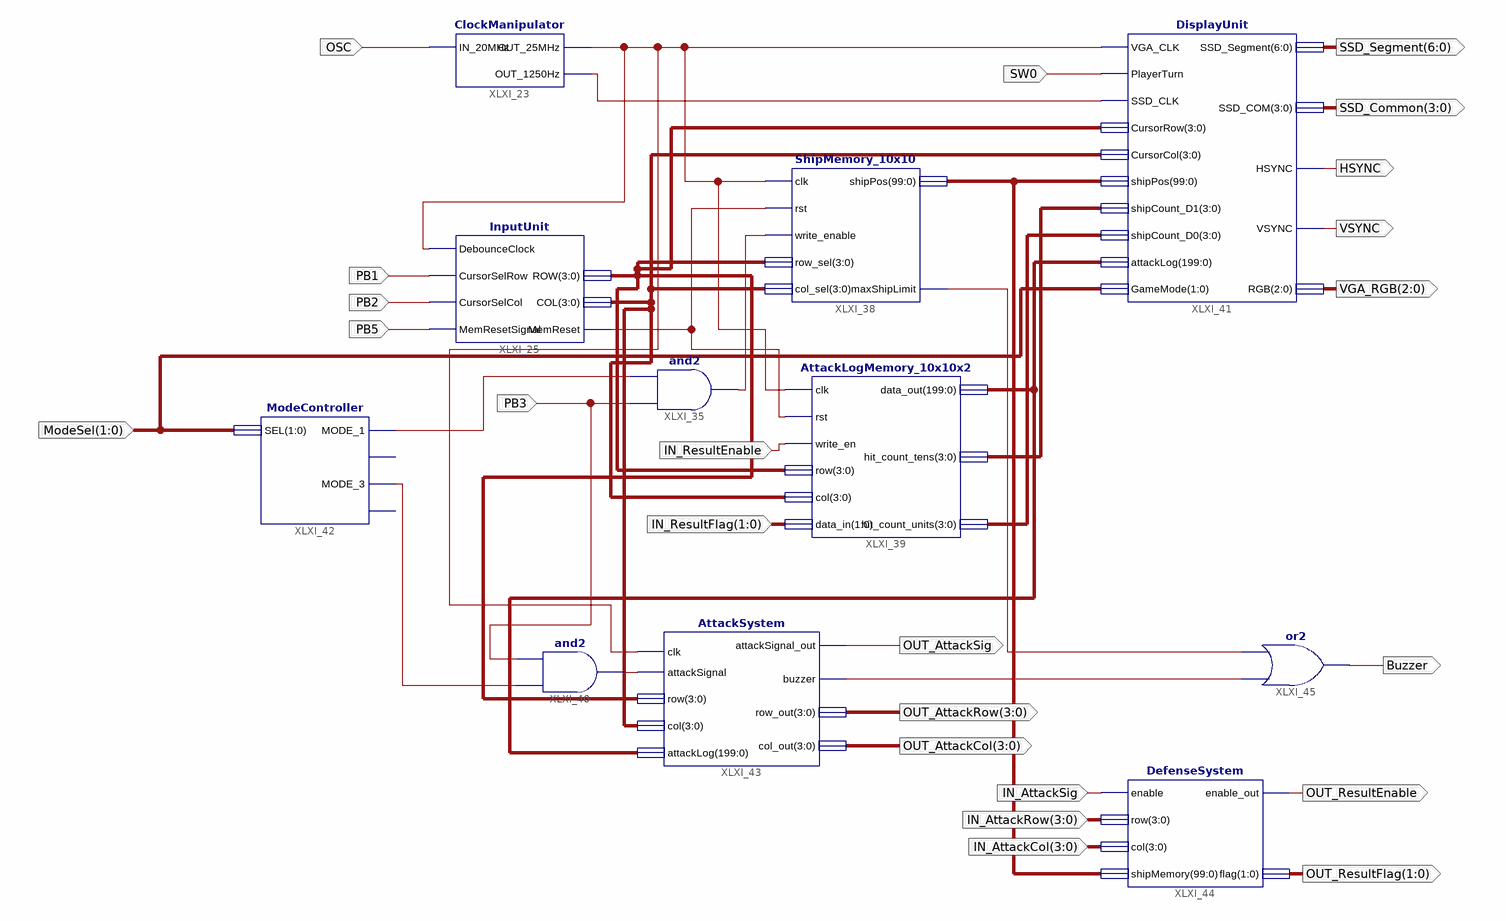
[diagram p0: schematic sheet 1]
// Xilinx ISE schematic FPGABattleship.sch (spartan6) as structural Verilog: 11 symbols, 23 ports
module FPGABattleship (
  input  OSC,
  input  PB1,
  input  PB2,
  input  PB5,
  input  PB3,
  input  [1:0] ModeSel,
  input  SW0,
  input  IN_ResultEnable,
  input  [1:0] IN_ResultFlag,
  input  IN_AttackSig,
  input  [3:0] IN_AttackRow,
  input  [3:0] IN_AttackCol,
  output [6:0] SSD_Segment,
  output [2:0] VGA_RGB,
  output [3:0] SSD_Common,
  output HSYNC,
  output VSYNC,
  output OUT_AttackSig,
  output [3:0] OUT_AttackCol,
  output [3:0] OUT_AttackRow,
  output OUT_ResultEnable,
  output [1:0] OUT_ResultFlag,
  output Buzzer
);

  wire XLXN_104, XLXN_135, XLXN_139, XLXN_235, XLXN_236, XLXN_237, XLXN_240, XLXN_309, XLXN_311;
  wire [3:0] XLXN_194, XLXN_290, XLXN_314, XLXN_315;
  wire [99:0] XLXN_305;
  wire [199:0] XLXN_291;

  ClockManipulator XLXI_23 (.IN_20MHz(OSC), .OUT_25MHz(XLXN_240), .OUT_1250Hz(XLXN_104));
  InputUnit XLXI_25 (
    .DebounceClock(XLXN_240), .CursorSelRow(PB1), .MemResetSignal(PB5), .CursorSelCol(PB2), .ROW(XLXN_290),
    .COL(XLXN_194), .MemReset(XLXN_135));
  and XLXI_35 (XLXN_139, PB3, XLXN_235);
  ShipMemory_10x10 XLXI_38 (
    .clk(XLXN_240), .rst(XLXN_135), .write_enable(XLXN_139), .row_sel(XLXN_290), .col_sel(XLXN_194),
    .maxShipLimit(XLXN_311), .shipPos(XLXN_305));
  ModeController XLXI_42 (.SEL(ModeSel), .MODE_1(XLXN_235), .MODE_3(XLXN_236));  // open: MODE_4, MODE_2
  AttackSystem XLXI_43 (
    .row(XLXN_290), .col(XLXN_194), .attackLog(XLXN_291), .attackSignal_out(OUT_AttackSig),
    .buzzer(XLXN_309), .row_out(OUT_AttackRow), .col_out(OUT_AttackCol), .clk(XLXN_240),
    .attackSignal(XLXN_237));
  and XLXI_40 (XLXN_237, XLXN_236, PB3);
  DisplayUnit XLXI_41 (
    .VGA_CLK(XLXN_240), .SSD_Segment(SSD_Segment), .SSD_COM(SSD_Common), .HSYNC(HSYNC), .VSYNC(VSYNC),
    .RGB(VGA_RGB), .PlayerTurn(SW0), .SSD_CLK(XLXN_104), .CursorRow(XLXN_290), .CursorCol(XLXN_194),
    .shipPos(XLXN_305), .shipCount_D1(XLXN_314), .shipCount_D0(XLXN_315), .attackLog(XLXN_291),
    .GameMode(ModeSel));
  DefenseSystem XLXI_44 (
    .enable(IN_AttackSig), .row(IN_AttackRow), .col(IN_AttackCol), .shipMemory(XLXN_305),
    .enable_out(OUT_ResultEnable), .flag(OUT_ResultFlag));
  AttackLogMemory_10x10x2 XLXI_39 (
    .clk(XLXN_240), .rst(XLXN_135), .write_en(IN_ResultEnable), .row(XLXN_290), .col(XLXN_194),
    .data_in(IN_ResultFlag), .data_out(XLXN_291), .hit_count_tens(XLXN_314), .hit_count_units(XLXN_315));
  or XLXI_45 (Buzzer, XLXN_309, XLXN_311);
endmodule
